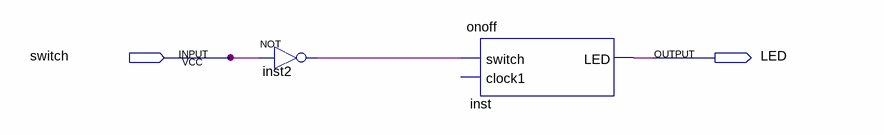
[diagram p0: schematic sheet]
// Quartus schematic DelayPractice.bdf as structural Verilog: 2 symbols, 2 pins
module DelayPractice (
  input  switch,
  output LED
);

  wire inst2_out;

  not inst2 (inst2_out, switch);
  onoff inst (.switch(inst2_out), .LED(LED));  // open: clock1
endmodule
